# EAGLE schematic OSO-SCAP-B1-01 Minimalist SAMD11 Sensor Cap (EAGLE 9.4.2)
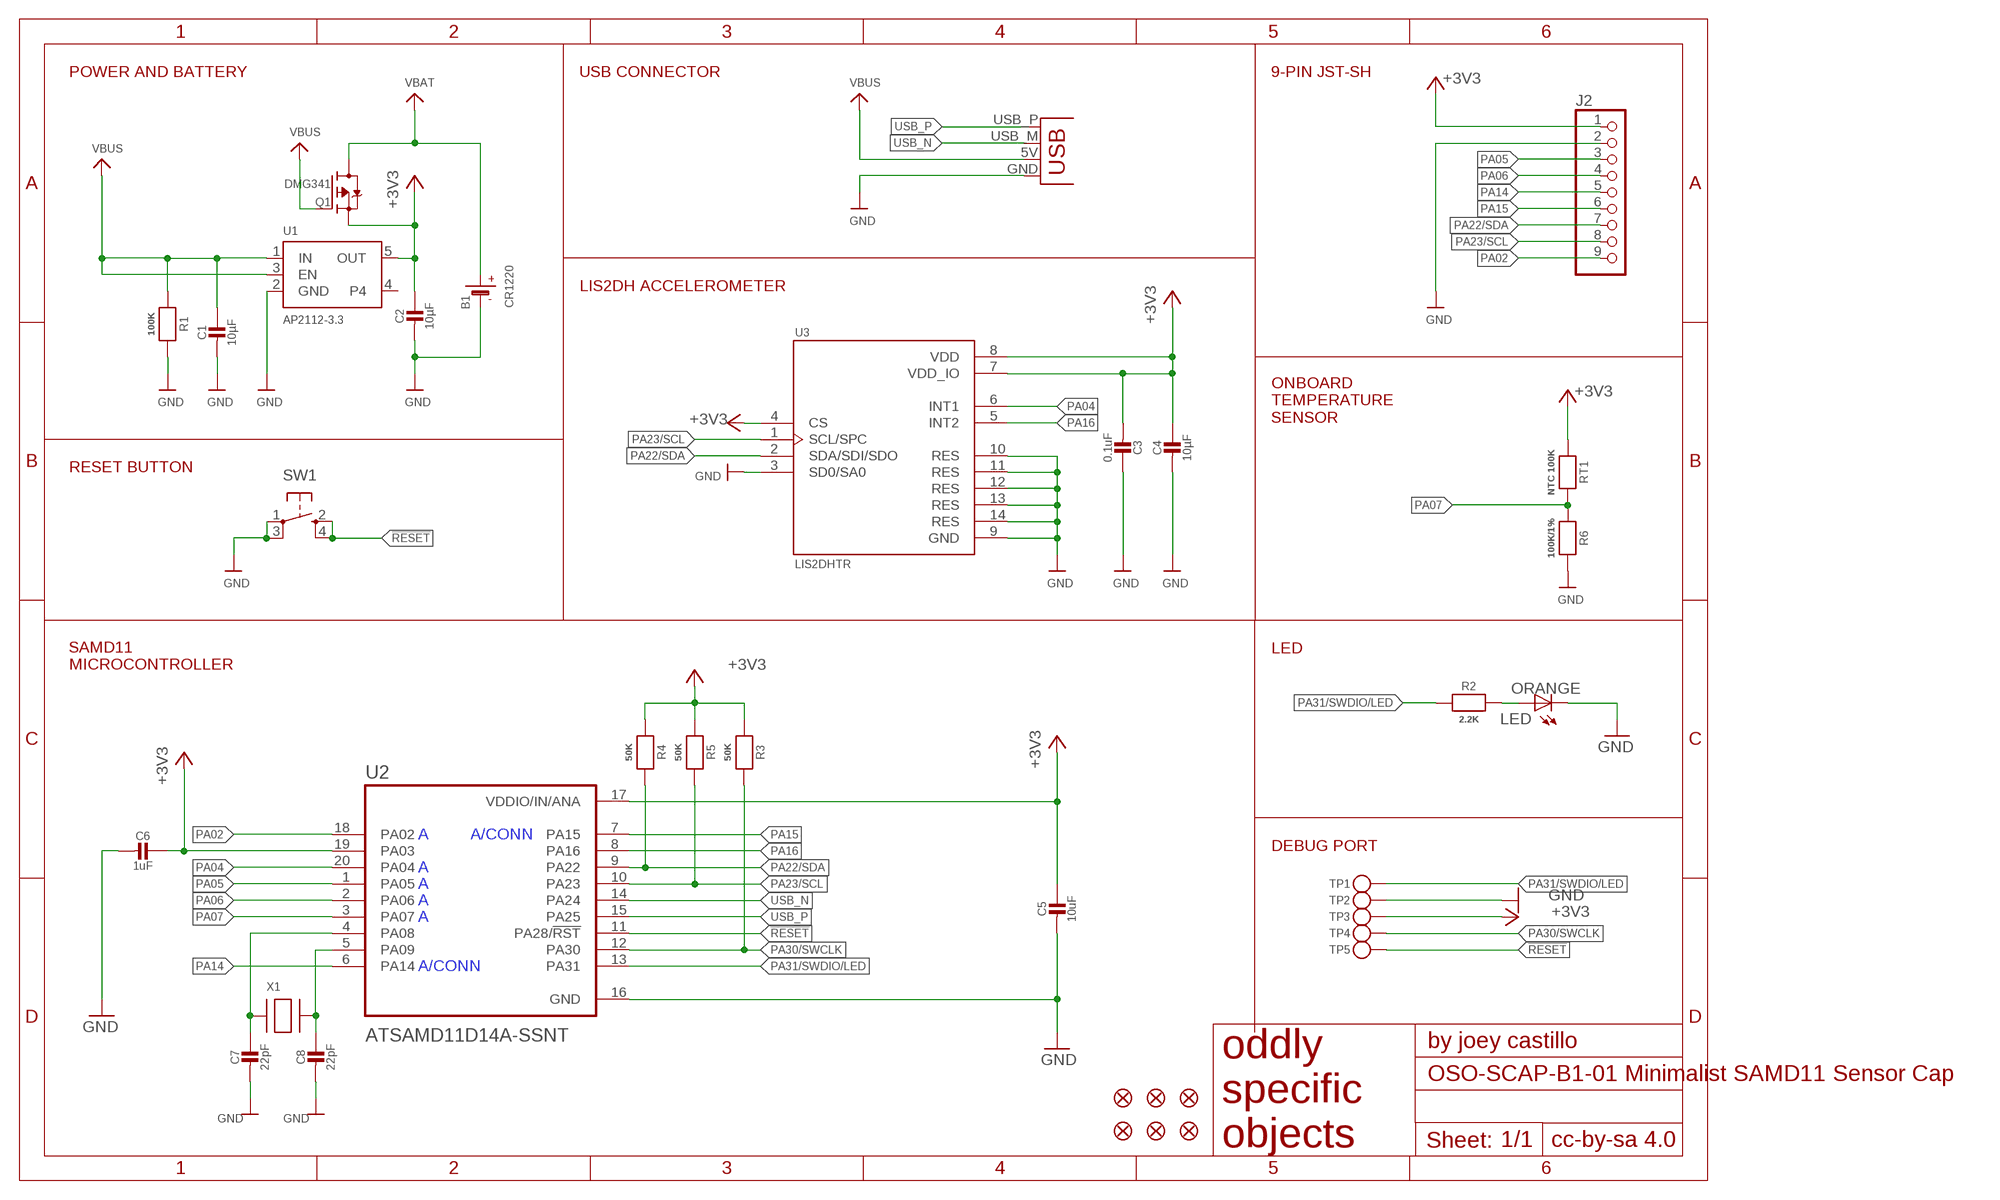
[diagram p0: schematic, sheet 1]

## Parts
B1  CR1220  BATTERYCR1220_SMT  [CR1220]
C1  10µF  CAP_CERAMIC0805-NOOUTLINE  [0805-NO]
C2  10µF  CAP_CERAMIC0805-NOOUTLINE  [0805-NO]
C3  0.1uF  CAP_CERAMIC0805-NOOUTLINE  [0805-NO]
C4  10µF  CAP_CERAMIC0805-NOOUTLINE  [0805-NO]
C5  10uF  CAP_CERAMIC0805-NOOUTLINE  [0805-NO]
C6  1uF  CAP_CERAMIC0805-NOOUTLINE  [0805-NO]
C7  22pF  CAP_CERAMIC0805-NOOUTLINE  [0805-NO]
C8  22pF  CAP_CERAMIC0805-NOOUTLINE  [0805-NO]
FID1  FIDUCIAL_1MM  [FIDUCIAL_1MM]
FID2  FIDUCIAL_1MM  [FIDUCIAL_1MM]
FID3  FIDUCIAL_1MM  [FIDUCIAL_1MM]
FID4  FIDUCIAL_1MM  [FIDUCIAL_1MM]
FID5  FIDUCIAL_1MM  [FIDUCIAL_1MM]
FID6  FIDUCIAL_1MM  [FIDUCIAL_1MM]
J1  USBPCB  [USB-A-PCB]
J2  HEADER-1X9_JSTSH  [JST_SH9]
LED  ORANGE  LEDCHIP-LED0805  [CHIP-LED0805]
Q1  DMG341  MOSFET-P  [SOT23-R]
R1  100K  RESISTOR0805_NOOUTLINE  [0805-NO]
R2  2.2K  RESISTOR0805_NOOUTLINE  [0805-NO]
R3  50K  RESISTOR0805_NOOUTLINE  [0805-NO]
R4  50K  RESISTOR0805_NOOUTLINE  [0805-NO]
R5  50K  RESISTOR0805_NOOUTLINE  [0805-NO]
R6  100K/1%  RESISTOR0805_NOOUTLINE  [0805-NO]
RT1  NTC 100K  RESISTOR0805_NOOUTLINE  [0805-NO]
SW1  SPST_TACT-KMR2  [KMR2]
TP1  TESTPOINTROUND2MMNO  [TESTPOINT_ROUND_2MM_NO]
TP2  TESTPOINTROUND2MMNO  [TESTPOINT_ROUND_2MM_NO]
TP3  TESTPOINTROUND2MMNO  [TESTPOINT_ROUND_2MM_NO]
TP4  TESTPOINTROUND2MMNO  [TESTPOINT_ROUND_2MM_NO]
TP5  TESTPOINTROUND2MMNO  [TESTPOINT_ROUND_2MM_NO]
U1  AP2112-3.3  VREG_SOT23-5  [SOT23-5]
U2  ATSAMD11D14A-SSNT  [SOIC127P1030X265-20N]
U3  LIS2DHTR  [PQFN35P200X200X100-14N]
X1  XTAL-3.2X1.5  [XTAL3215]

## Nets
!RESET: SW1.2(S) SW1.4(S1) TP5.P$1 U2.11(PA28/!RST)
+3V3: C2.1 C3.2 C4.1 C5.1 C6.1 J2.1 Q1.2(S) R3.1 R4.1 R5.1 RT1.1 TP3.P$1 U1.5(OUT) U2.17(VDDIO/IN/ANA) U2.19(PA03) U3.4(CS) U3.7(VDD_IO) U3.8(VDD)
GND [gnd]: B1.- C1.2 C2.2 C3.1 C4.2 C5.2 C6.2 C7.2 C8.2 J1.GND J2.2 LED.C R1.2 R6.2 SW1.1(P) SW1.3(P1) TP2.P$1 U1.2(GND) U2.16(GND) U3.3(SD0/SA0) U3.9(GND) U3.10(RES) U3.11(RES) U3.12(RES) U3.13(RES) U3.14(RES)
N$5: LED.A R2.2
PA02: J2.9 U2.18(PA02)
PA04: U2.20(PA04) U3.6(INT1)
PA05: J2.3 U2.1(PA05)
PA06: J2.4 U2.2(PA06)
PA07: R6.1 RT1.2 U2.3(PA07)
PA14: J2.5 U2.6(PA14)
PA15: J2.6 U2.7(PA15)
PA16: U2.8(PA16) U3.5(INT2)
PA22/SDA: J2.7 R4.2 U2.9(PA22) U3.2(SDA/SDI/SDO)
PA23/SCL: J2.8 R5.2 U2.10(PA23) U3.1(SCL/SPC)
PA30/SWCLK: R3.2 TP4.P$1 U2.12(PA30)
PA31/SWDIO/LED: R2.1 TP1.P$1 U2.13(PA31)
USB_N: J1.USB_M(D-) U2.14(PA24)
USB_P: J1.USB_P(D+) U2.15(PA25)
VBAT [power]: B1.+$1(+) B1.+$2(+) Q1.3(D)
VBUS [power]: C1.1 J1.5V(VBUS) Q1.1(G) R1.1 U1.1(IN) U1.3(EN)
XIN32: C7.1 U2.4(PA08) X1.P$1
XOUT32: C8.1 U2.5(PA09) X1.P$2
Unconnected: U1.4

## Notes on the sheet
- POWER AND BATTERY | USB CONNECTOR | 9-PIN JST-SH
- LIS2DH ACCELEROMETER
- ONBOARD
  TEMPERATURE
  SENSOR
- RESET BUTTON
- LED
- SAMD11
  MICROCONTROLLER
- A | A/CONN
- DEBUG PORT
- A
- A
- A
- A
- A/CONN

## Library data of the parts
B1 = microbuilder:BATTERY: CR1220 SMT - Digikey: 3001K-ND CD2032 BAT-HLD-001 - Digikey: BAT-HLD-001-ND
C1-C8 = microbuilder:CAP_CERAMIC: Ceramic Capacitors For new designs, use the packages preceded by an '_' character since they are more reliable: The following footprints should be used on most boards: _0402 - Standard footprint for regular board layouts _0603 - Standard footprint for regular board layouts _0805 - Standard footprint for regular board layouts _1206 - Standard footprint for regular board layouts For extremely tight-pitch boards where space is at a premium, the following 'micro-pitch' footprints can be used (smaller pads, no silkscreen outline, etc.): _0402MP - Micro-pitch footprint for very dense/compact boards _0603MP - Micro-pitch footprint for very dense/compact boards _0805MP - Micro-pitch footprint for very dense/compact boards _1206MP - Micro-pitch footprint for very dense/compact boards
FID1-FID6 = microbuilder:FIDUCIAL: Fiducial Alignment Points Various fiducial points for machine vision alignment.; BOM: EXCLUDE
J1 = SparkFun:USB: USB Connectors USB-B-PTH is fully proven SKU : PRT-00139 USB-miniB is fully proven SKU : PRT-00587 USB-A-PCB is untested. USB-A-H is throughly reviewed, but untested. Spark Fun Electronics SKU : PRT-00437 USB-B-SMT is throughly reviewed, but untested. Needs silkscreen touching up. USB-A-S has not been used/tested USB-MB-H has not been used/tested
J2 = microbuilder:HEADER-1X9: PIN HEADER
LED = adafruit:LED: LED OSRAM: - CHIPLED LG R971, LG N971, LY N971, LG Q971, LY Q971, LO R971, LY R971 LH N974, LH R974 LS Q976, LO Q976, LY Q976 LO Q996 - Hyper CHIPLED LW Q18S LB Q993, LB Q99A, LB R99A - SideLED LS A670, LO A670, LY A670, LG A670, LP A670 LB A673, LV A673, LT A673, LW A673 LH A674 LY A675 LS A676, LA A676, LO A676, LY A676, LW A676 LS A679, LY A679, LG A679 - Hyper Micro SIDELED® LS Y876, LA Y876, LO Y876, LY Y876 LT Y87S - SmartLED LW L88C, LW L88S LB L89C, LB L89S, LG L890 LS L89K, LO L89K, LY L89K LS L896, LA L896, LO L896, LY L896 - TOPLED LS T670, LO T670, LY T670, LG T670, LP T670 LSG T670, LSP T670, LSY T670, LOP T670, LYG T670 LG T671, LOG T671, LSG T671 LB T673, LV T673, LT T673, LW T673 LH T674 LS T676, LA T676, LO T676, LY T676, LB T676, LH T676, LSB T676, LW T676 LB T67C, LV T67C, LT T67C, LS T67K, LO T67K, LY T67K, LW E67C LS E67B, LA E67B, LO E67B, LY E67B, LB E67C, LV E67C, LT E67C LW T67C LS T679, LY T679, LG T679 LS T770, LO T770, LY T770, LG T770, LP T770 LB T773, LV T773, LT T773, LW T773 LH T774 LS E675, LA E675, LY E675, LS T675 LS T776, LA T776, LO T776, LY T776, LB T776 LHGB T686 LT T68C, LB T68C - Hyper Mini TOPLED® LB M676 - Mini TOPLED Santana® LG M470 LS M47K, LO M47K, LY M47K Source: http://www.osram.convergy.de/
Q1 = microbuilder:MOSFET-P: P-Channel Mosfet LEGEND VDS: Voltage Drain-Source ID: Drain Current RDS(ON): Drain-Source On-State Resistance VGS(TH): Gate-Source Threshold Voltage CISS: Drain-Source Input Capacitance SOT-23 Name VDS ID RDS(ON) VGS(TH) CISS Order Number IRLML5103 30V 760mA 600 mOhm -- 75pF @ 25V Digikey: IRLML5103PBFCT-ND IRLML6401 12V 4.3A 50 mOhm 950mV @ 250µA 830pF @ 10V Digikey: IRLML6401PBFTR-ND NTR0202PL 20V 400mA 800 mOhm 2.3V @ 250uA 70pF @ 5V Digikey: NTR0202PLT1GOSTR-ND NTR4101PT1G 20V 1.8A 85 mOhm 1.2V @ 250uA 675pF @ 10V Digikey: NTR4101PT1GOSCT-ND DMP2004K 20V 600mA 900 mOhm 1V @ 250uA 175pF @ 16V Digikey: DMP2004KDICT-ND PMV65XP 20V 3.9A 76 mOhm 950mV @ 1mA 725pF @ 20V Digikey: 568-2358-2-ND TO-252 Name VDS ID RDS(ON) VGS(TH) CISS Order Number AOD417 30V 25A 34 mOhm 3V @ 250µA 920pF @ 15V Digikey: 785-1106-2-ND PowerPak Name VDS ID RDS(ON) VGS(TH) CISS Order Number AON7401 30V 12A 14 mOhm 3V @ 250µA 2600pF @ 15V Digikey: 785-1302-1-ND
R1-R6 RT1 = microbuilder:RESISTOR: Resistors For new designs, use the packages preceded by an '_' character since they are more reliable: The following footprints should be used on most boards: _0402 - Standard footprint for regular board layouts _0603 - Standard footprint for regular board layouts _0805 - Standard footprint for regular board layouts _1206 - Standard footprint for regular board layouts For extremely tight-pitch boards where space is at a premium, the following 'micro-pitch' footprints can be used (smaller pads, no silkscreen outline, etc.): _0402MP - Micro-pitch footprint for very dense/compact boards _0603MP - Micro-pitch footprint for very dense/compact boards _0805MP - Micro-pitch footprint for very dense/compact boards _1206MP - Micro-pitch footprint for very dense/compact boards
SW1 = adafruit:SPST_TACT: SMT 6mm switch, EVQQ2 series http://www.ladyada.net/library/eagle
TP1-TP5 = microbuilder:TESTPOINT: Test Point Various test points for characterisation and PCB testing TESTPOINT_SMT - Compact Surface Mount Test Point [Digikey: 5016KTR-ND]
U1 = microbuilder:VREG_SOT23-5: SOT23-5 Fixed Voltage Regulators Part Current Out V Out V In V Dropout θJA (°C/W) TJ (°C) Digikey Part No. ADP121 150mA 3.3V 3.4-5.5V 0.09V @ 150mA -- -- ADP121-AUJZ33R7CT-ND ADP121 150mA 3.0V 3.1-5.5V 0.09V @ 150mA -- -- ADP121-AUJZ30R7CT-ND ADP122 300mA 3.3V 3.4-5.5V 0.085V @ 300mA -- -- ADP122AUJZ-3.3-R7CT-ND ADP1712 300mA 3.3V 3.5-5.5V 0.17V @ 300mA -- -- ADP1712AUJZ-3.3-R7TR-ND AP7311 (Low Cost) 150mA 3.3V 3.5-6V 0.15V @ 150mA -- -- AP7311-33WG-7DICT-ND LD39015M18R 150mA 1.8V 1.9V-5.5V 0.08V @ 100mA -- -- 497-6977-1-ND LP2985A-33DBVR 150mA 3.3V 3.3-16V 0.28V @ 150mA 206 150 296-18479-1-ND MCP1824T-3302E/OT 300mA 3.3V 3.5V-6V 0.2V @ 300mA -- -- MCP1824T-3302E/OTCT-ND MIC5205-2.5YM5 TR 150mA 2.5V 2.7-16V 0.165V @ 150mA -- -- 576-1257-2-ND MIC5205-3.0YM5 TR 150mA 3.0V 3.2V-16V 0.165V @ 150mA -- -- 576-1258-2-ND MIC5205-3.3YM5 TR 150mA 3.3V 3.5V-16V 0.165V @ 150mA -- -- 576-1259-2-ND TPS780330220 150mA 3.3V+2.2V 3.6-5.5V 250mV Max -- -- 296-23332-1-ND TDA3663/N1,135 100mA 3.3V 3.5-45V 0.18V @ 50mA -- -- 568-5343-1-ND Max operating temp can be calculated using θJA, TJ (max junction temperature), and power in watts. Set the "Maximum Ambient Temperature" until it reaches TJ ("Max Junction Temperature"), which is the absolute limit for safe use of the regulator: Heat Sink Temperature Calculator <http://www.daycounter.com/Calculators/Heat-Sink-Temperature-Calculator.phtml> For example, With 12V source into a 3.3V LP2985 and a 30mA load, we are dissipating (12V-3.3V) * 0.03A = 0.261W. With a θJA of 206 °C/W, a TJ of 150°C, and 261mW we can safely use the chip without a heat sink up to 75°C (=147.1°C Junction Temperature).
U2 = ATSAMD11D14A-SSNT:ATSAMD11D14A-SSNT: None; AVAILABILITY: Unavailable; DESCRIPTION: Cortex-M0+, 16kb Flash, 4kb Sram, Usb - 20 Soic, 105c, Green, 1.6-3.6v, 48mhz, Usb/ Eiqj/Soic _s_; MF: Microchip; MP: ATSAMD11D14A-SSNT; PACKAGE: SOIC-20 Atmel; PRICE: None
U3 = LIS2DHTR:LIS2DHTR: MEMS digital output motion sensor: ultra low-power high performance 3-axes femto accelerometer; DESCRIPTION: Accelerometer X, Y, Z Axis ±2g, 4g, 8g, 16g 0.5Hz ~ 672Hz 14-LGA _2x2_; DIGI-KEY_PART_NUMBER: 497-13795-1-ND; DIGI-KEY_PURCHASE_URL: https://www.digikey.com/product-detail/en/stmicroelectronics/LIS2DHTR/497-13795-1-ND/4209308?utm_source=snapeda&utm_medium=aggregator&utm_campaign=symbol; MF: STMicroelectronics; MP: LIS2DHTR; PACKAGE: LGA-14 STMicroelectronics
X1 = adafruit:XTAL: Low cost SMT crystals, no capacitors included http://www.ladyada.net/library/eagle

## Net classes
0 default: width 0.152 mm, drill 0.254 mm
1 power: width 0.305 mm, drill 0.305 mm